# EAGLE design net_monitor (EAGLE 9.6.2)
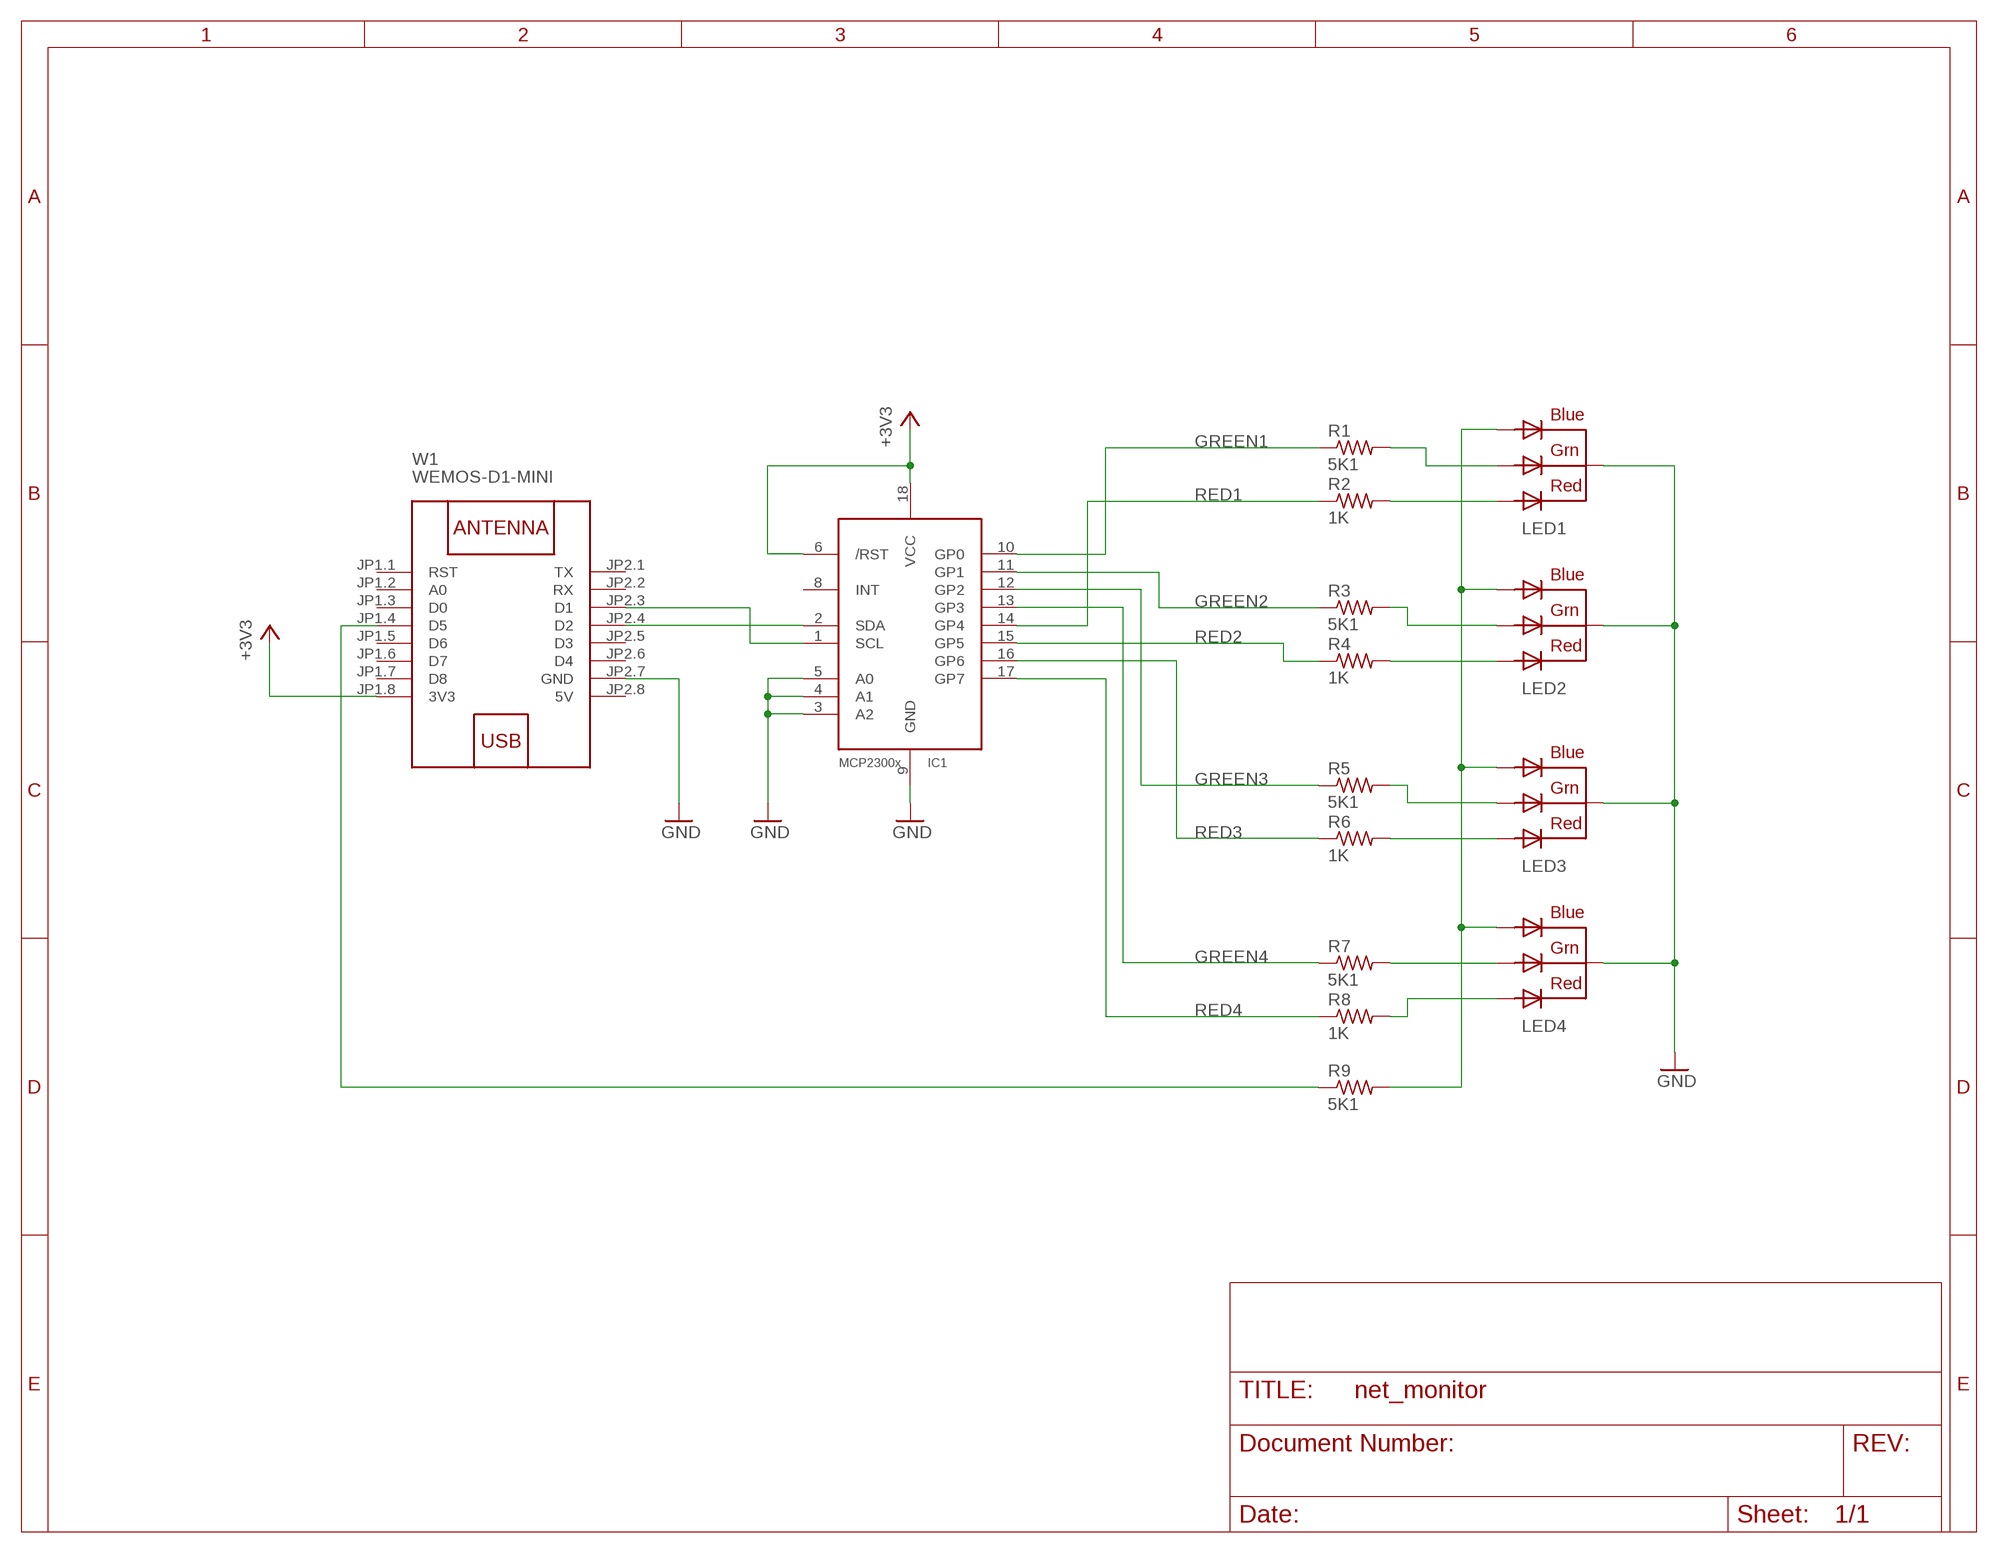
[diagram p0: schematic, sheet 1]

## Parts
IC1  MCP23008/P  [DIL18]
LED1  RGBLED_CC  [LED5MMRGB]
LED2  RGBLED_CC  [LED5MMRGB]
LED3  RGBLED_CC  [LED5MMRGB]
LED4  RGBLED_CC  [LED5MMRGB]
R1  5K1  R-US_0207/10  [0207/10]
R2  1K  R-US_0207/10  [0207/10]
R3  5K1  R-US_0207/10  [0207/10]
R4  1K  R-US_0207/10  [0207/10]
R5  5K1  R-US_0207/10  [0207/10]
R6  1K  R-US_0207/10  [0207/10]
R7  5K1  R-US_0207/10  [0207/10]
R8  1K  R-US_0207/10  [0207/10]
R9  5K1  R-US_0207/10  [0207/10]
W1  WEMOS-D1-MINI  [WEMOS-D1-MINI]

## Nets
+3V3: IC1.6(/RST) IC1.18(VCC) W1.JP1.8(3V3)
GND: IC1.3(A2) IC1.4(A1) IC1.5(A0) IC1.9(GND) LED1.2(CATHODE) LED2.2(CATHODE) LED3.2(CATHODE) LED4.2(CATHODE) W1.JP2.7(GND)
GREEN1: IC1.10(GP0) R1.1
GREEN2: IC1.11(GP1) R3.1
GREEN3: IC1.12(GP2) R5.1
GREEN4: IC1.13(GP3) R7.1
N$1: LED4.3(GREEN) R7.2
N$2: LED1.3(GREEN) R1.2
N$3: LED1.4(BLUE) LED2.4(BLUE) LED3.4(BLUE) LED4.4(BLUE) R9.2
N$4: LED1.1(RED) R2.2
N$5: LED3.3(GREEN) R5.2
N$6: LED3.1(RED) R6.2
N$7: LED2.3(GREEN) R3.2
N$8: LED2.1(RED) R4.2
N$9: IC1.1(SCL) W1.JP2.3(D1)
N$10: LED4.1(RED) R8.2
N$19: R9.1 W1.JP1.4(D5)
N$20: IC1.2(SDA) W1.JP2.4(D2)
RED1: IC1.14(GP4) R2.1
RED2: IC1.15(GP5) R4.1
RED3: IC1.16(GP6) R6.1
RED4: IC1.17(GP7) R8.1
Unconnected: IC1.8(INT) W1.JP1.1(RST) W1.JP1.2(A0) W1.JP1.3(D0) W1.JP1.5(D6) W1.JP1.6(D7) W1.JP1.7(D8) W1.JP2.1(TX) W1.JP2.2(RX) W1.JP2.5(D3) W1.JP2.6(D4)

## Power pins joined to a net without a drawn wire
5V: W1.JP2.8(5V)

## Library data of the parts
IC1 = adafruit:MCP23008: MCP23008 Inexpensive i2c i/o expander - 8 general purpose i/o pins with optional pullups; OC_NEWARK: unknown
LED1-LED4 = myParts:RGBLED_CC
R1 R3 R5 R7 R9 = adafruit:R-US_: RESISTOR, American symbol; MPN: CRCW12065K10FKEA; OC_NEWARK: 89M6878
R2 R4 R6 R8 = adafruit:R-US_: RESISTOR, American symbol; OC_NEWARK: unknown
W1 = diy-modules:WEMOS-D1-MINI: WEMOS D1 mini: Mini Wi-Fi Board based on ESP-8266 device More details can be found here: https://www.wemos.cc/product/d1-mini.html Click here to find device on ebay.com <http://www.ebay.com/sch/wemos+d1+mini+nodemcu>; OC_NEWARK: unknown

## Board
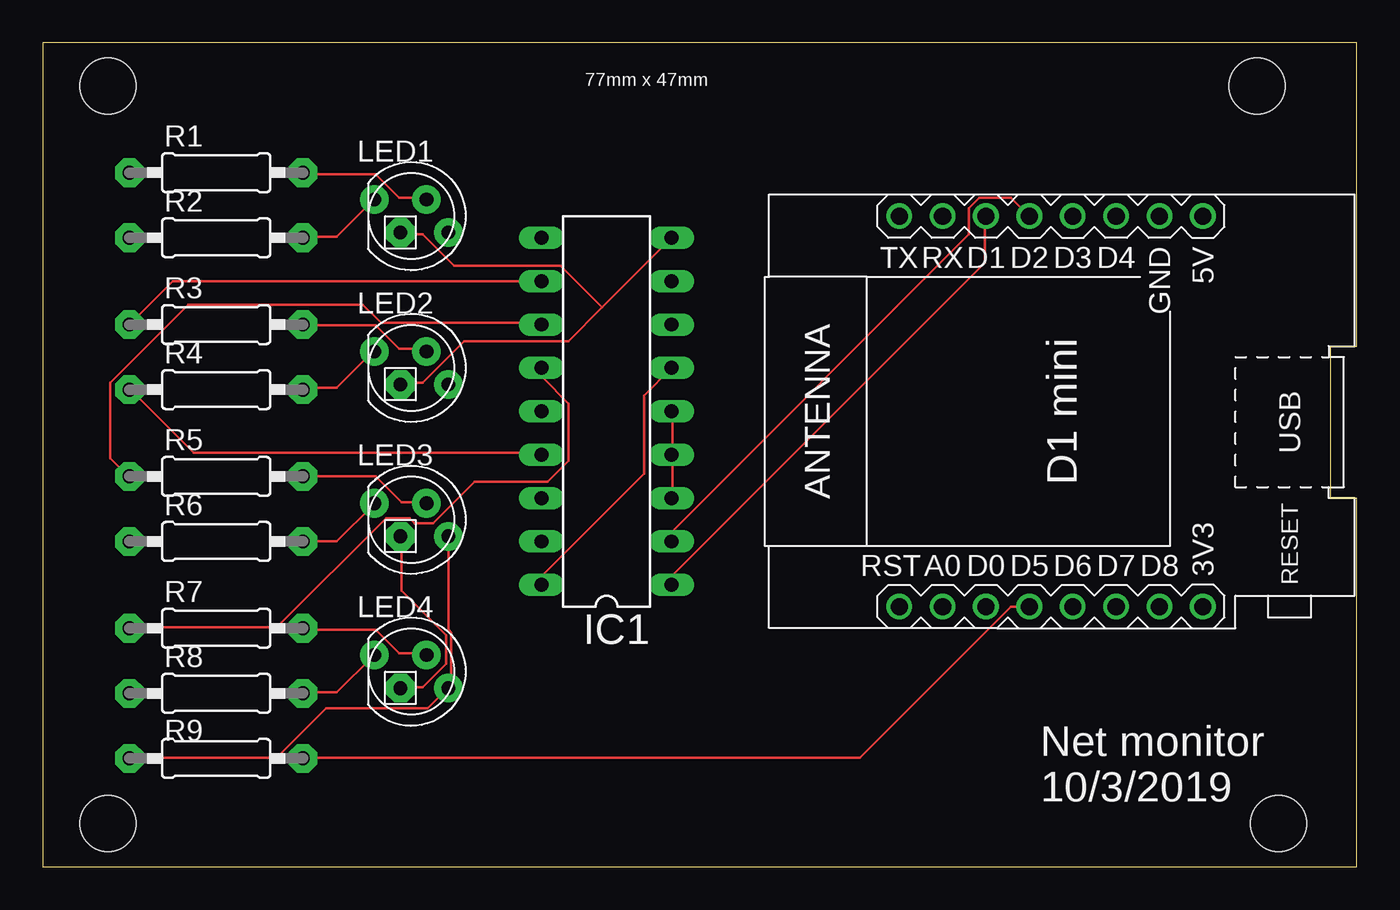
[diagram p1: board, top side]
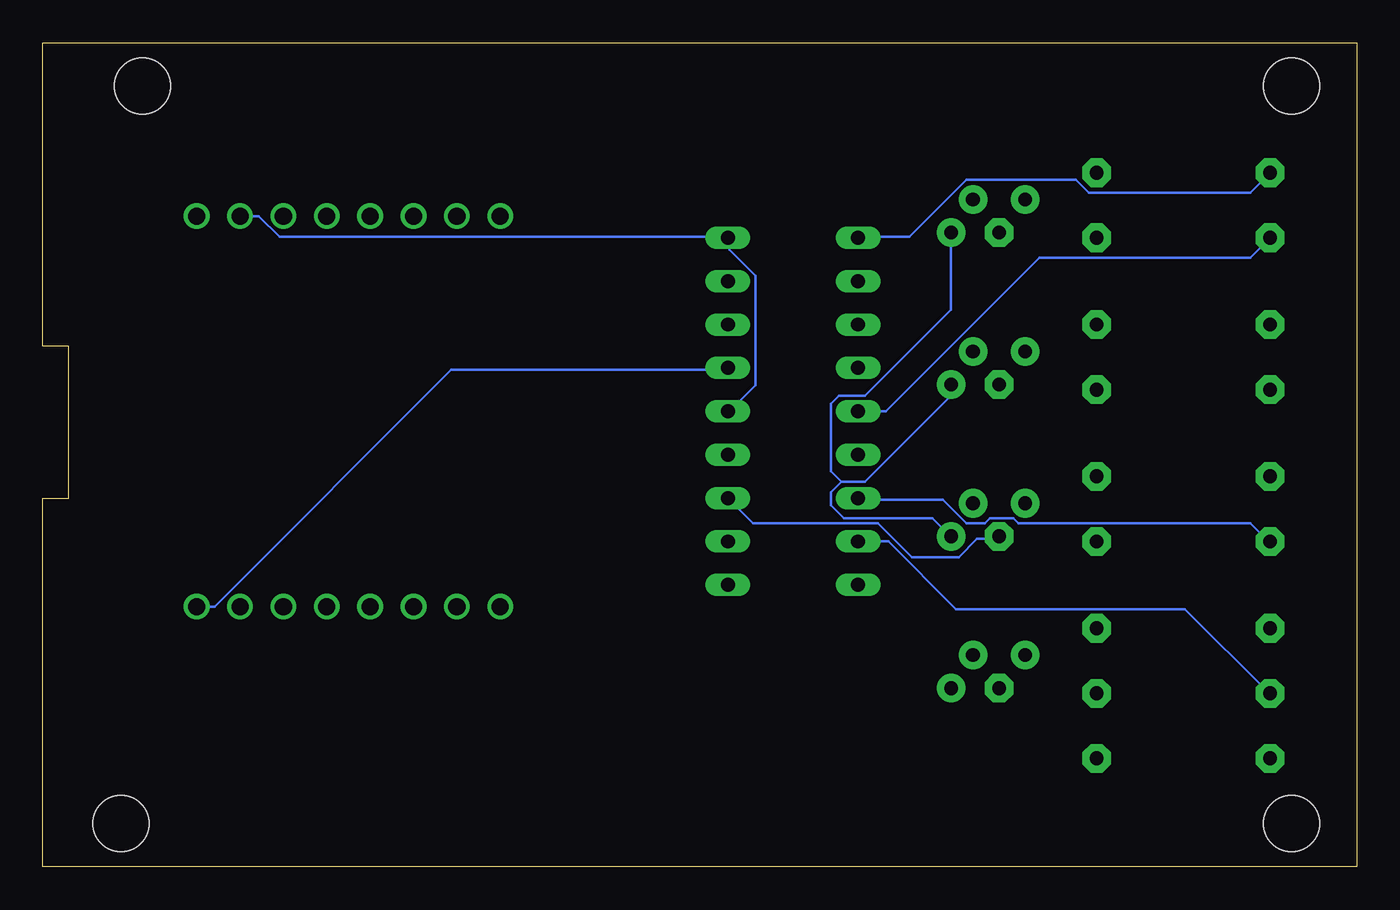
[diagram p2: board, bottom side, seen from below]

Size 76.96 x 48.25 mm. Coordinates in mm from the lower left corner, seen from the top.
Outline: 0,0 76.96,0 76.96,21.59 75.44,21.59 75.44,30.48 76.96,30.48 76.96,48.25 0,48.25 0,0
Copper layers (1*16): Top 0.035mm / dielectric 1.5mm / Bottom 0.035mm
Design rules "default": minimum track width 6mil, minimum drill 0.35mm, track to track 6mil, track to pad 6mil, pad to pad 6mil, via to via 6mil, smd to smd 6mil, copper to edge 40mil, drill to drill 6mil, minimum pad ring 10mil, minimum via ring 8mil, stop-mask expansion 4mil, vias tented up to drill 0mil, thermal gap 10mil
Holes 3.26 mm at 3.81,45.72 3.81,2.54 72.39,2.54 71.12,45.72

### Footprints (pad centres in the part's own frame; a part is rotated, then mirrored left to right if it is on the bottom)
DIL18 = drill 0.813 long: 1 -10.16,-3.81; 2 -7.62,-3.81; 3 -5.08,-3.81; 4 -2.54,-3.81; 5 0,-3.81; 6 2.54,-3.81; 7 5.08,-3.81; 8 7.62,-3.81; 9 10.16,-3.81; 10 10.16,3.81; 11 7.62,3.81; 12 5.08,3.81; 13 2.54,3.81; 14 0,3.81; 15 -2.54,3.81; 16 -5.08,3.81; 17 -7.62,3.81; 18 -10.16,3.81
LED5MMRGB = drill 0.8 pad 1.676: 1 -2.159,0.968; 3 0.889,0.968; 4 2.159,-0.968 | drill 0.8 pad 1.676 octagon: 2 -0.635,-0.968
0207/10 = drill 0.813 pad 1.676 octagon: 1 -5.08,0; 2 5.08,0
WEMOS-D1-MINI = drill 1: JP1.1 -11.43,9.525; JP1.2 -11.43,6.985; JP1.3 -11.43,4.445; JP1.4 -11.43,1.905; JP1.5 -11.43,-0.635; JP1.6 -11.43,-3.175; JP1.7 -11.43,-5.715; JP1.8 -11.43,-8.255; JP2.1 11.43,9.525; JP2.2 11.43,6.985; JP2.3 11.43,4.445; JP2.4 11.43,1.905; JP2.5 11.43,-0.635; JP2.6 11.43,-3.175; JP2.7 11.43,-5.715; JP2.8 11.43,-8.255

### Placement (x,y rotation side)
IC1  33.02,26.67 90 top
LED1  21.59,38.1 0 top
LED2  21.59,29.21 0 top
LED3  21.59,20.32 0 top
LED4  21.59,11.43 0 top
R1  10.16,40.64 0 top
R2  10.16,36.83 0 top
R3  10.16,31.75 0 top
R4  10.16,27.94 0 top
R5  10.16,22.86 0 top
R6  10.16,19.05 0 top
R7  10.16,13.97 0 top
R8  10.16,10.16 0 top
R9  10.16,6.35 180 top
W1  59.69,26.67 90 top

### Tracks (layer width: path | path; a pad name or v marks a point on that pad's centre or on a via)
+3V3
  Top 0.152: IC1.6 35.2,27.58 35.2,23.01 29.26,17.07 29.26,16.61 IC1.18
  Bottom 0.152: W1.JP1.8 66.9,15.24 53.03,29.11 36.88,29.11 IC1.6
GND
  Top 0.152: LED4.2 21.03,10.52 22.25,10.52 23.62,11.89 23.62,13.56 21.03,16.15 21.03,19.2 LED3.2 | IC1.3 36.88,21.64 36.88,24.08 IC1.4 36.88,24.23 36.88,26.67 IC1.5 | IC1.9 32.77,32.77 | 32.77,32.77 30.79,30.79 24.69,30.79 22.25,28.35 21.03,28.35 LED2.2 | 32.77,32.77 30.33,35.2 24.08,35.2 22.25,37.03 21.03,37.03 LED1.2
  Bottom 0.152: IC1.5 36.73,26.67 35.2,28.19 35.2,34.59 36.73,36.12 36.73,36.73 IC1.9 36.88,36.88 63.09,36.88 64.31,38.1 W1.JP2.7 | IC1.3 35.36,20.12 28.04,20.12 26.06,18.14 23.32,18.14 22.25,19.2 21.03,19.2 LED3.2
GREEN1
  Bottom 0.152: R1.1 6.25,39.47 15.7,39.47 16.46,40.23 22.86,40.23 26.21,36.88 29.11,36.88 IC1.10
GREEN2
  Top 0.152: IC1.11 7.62,34.29 R3.1
GREEN3
  Top 0.152: IC1.12 29.11,31.85 19.81,31.85 18.75,32.92 8.53,32.92 3.96,28.35 3.96,23.93 5.03,22.86 R5.1
GREEN4
  Top 0.152: IC1.13 29.26,29.11 29.26,28.65 30.79,27.13 30.79,23.77 29.57,22.55 25.3,22.55 22.86,20.12 21.79,20.12 21.49,20.42 20.12,20.42 13.72,14.02 5.18,14.02 R7.1
N$1
  Top 0.152: LED4.3 22.4,12.5 20.88,12.5 19.51,13.87 15.24,13.87 R7.2
N$2
  Top 0.152: LED1.3 22.4,39.17 20.88,39.17 19.51,40.54 15.24,40.54 R1.2
N$3
  Top 0.152: R9.2 5.18,6.4 13.72,6.4 16.61,9.3 22.55,9.3 23.62,10.36 LED4.4 23.77,10.52 23.93,10.67 23.93,13.72 23.77,13.87 23.77,19.2 LED3.4
  Bottom 0.152: 30.18,22.55 28.8,22.55 23.77,27.58 23.77,28.19 LED2.4 | 30.18,22.55 30.79,21.95 30.79,21.18 30.02,20.42 24.84,20.42 23.77,19.36 LED3.4 | 30.18,22.55 30.79,23.16 30.79,27.13 30.33,27.58 28.8,27.58 23.77,32.61 23.77,37.03 LED1.4
N$4
  Top 0.152: R2.2 15.24,36.88 17.22,36.88 19.36,39.01 LED1.1
N$5
  Top 0.152: R5.2 19.51,22.86 21.03,21.34 22.4,21.34 LED3.3
N$6
  Top 0.152: R6.2 17.22,19.05 19.36,21.18 LED3.1
N$7
  Top 0.152: LED2.3 22.4,30.33 20.88,30.33 19.51,31.7 15.24,31.7 R3.2
N$8
  Top 0.152: R4.2 15.24,28.04 17.22,28.04 19.36,30.18 LED2.1
N$9
  Top 0.152: IC1.1 36.88,16.61 36.88,17.07 55.17,35.36 55.17,38.1 W1.JP2.3
N$10
  Top 0.152: R8.2 15.24,10.21 17.22,10.21 19.36,12.34 LED4.1
N$19
  Top 0.152: W1.JP1.4 56.69,15.24 47.85,6.4 15.24,6.4 R9.1
N$20
  Top 0.152: IC1.2 36.88,19.05 36.88,19.66 54.25,37.03 54.25,38.56 54.86,39.17 56.69,39.17 57.76,38.1 W1.JP2.4
RED1
  Bottom 0.152: IC1.14 27.58,26.67 18.59,35.66 6.25,35.66 R2.1
RED2
  Top 0.152: IC1.15 29.11,24.23 8.84,24.23 5.18,27.89 R4.1
RED3
  Bottom 0.152: IC1.16 29.11,21.49 24.23,21.49 22.86,20.12 21.79,20.12 21.49,20.42 20.12,20.42 19.81,20.12 6.25,20.12 5.18,19.05 R6.1
RED4
  Bottom 0.152: IC1.17 27.43,19.05 23.47,15.09 10.06,15.09 5.18,10.21 R8.1

### Text on the board
tPlace: 77mm x 47mm | Net monitor / 10/3/2019